# Altium schematic sheet KEYBOARD.SchDoc: KEYBOARD
size A4; Date: 30 08 2013; Author: Rachid AKKOUCHE; CompanyName: MDI; DrawnBy: Rachid AKKOUCHE; Organization: RASoftware; Address1: 52 J03, rue de la crèche; Address2: 77100 MEAUX; Address3: FRANCE; DocumentNumber: BRA201308306C; Revision: C; SheetNumber: 6; SheetTotal: 11; Telephone: +33651604047; Email: rachid.akkouche@wanadoo.fr; Proprietaire: MDI System; Dessinepar: -; Verifiepar: -; Time: 19:00
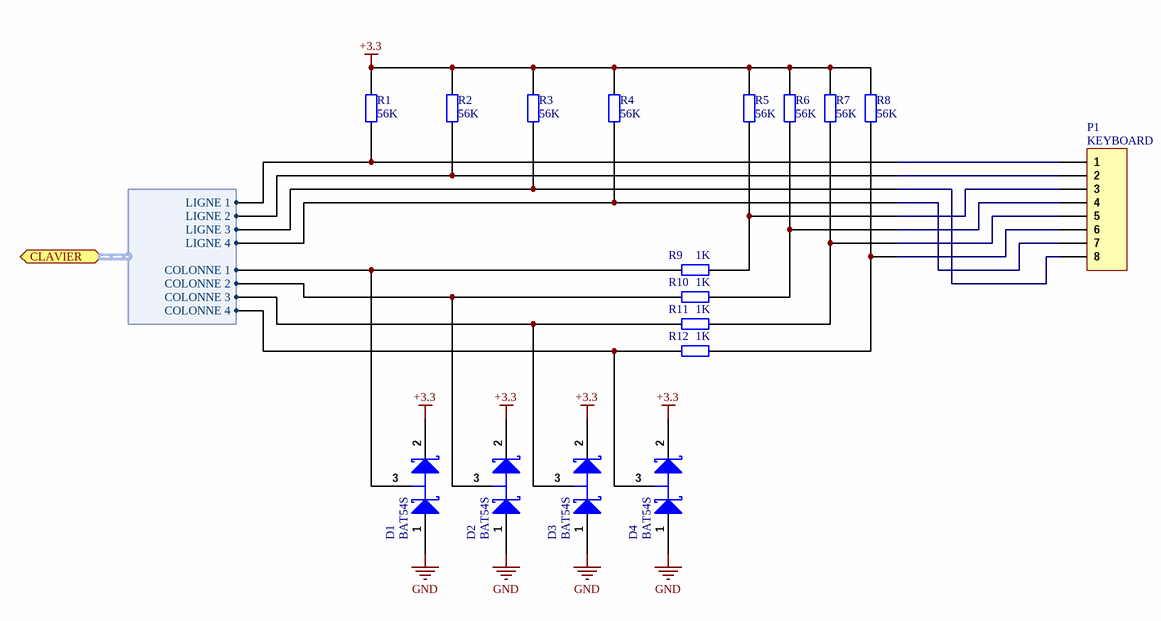
[diagram p0: KEYBOARD.SchDoc]

## Parts
D1  BAT54S  [SOT-23]
D2  BAT54S  [SOT-23]
D3  BAT54S  [SOT-23]
D4  BAT54S  [SOT-23]
P1  KEYBOARD  [M20_1X8]
R1  56K  [R0805]
R2  56K  [R0805]
R3  56K  [R0805]
R4  56K  [R0805]
R5  56K  [R0805]
R6  56K  [R0805]
R7  56K  [R0805]
R8  56K  [R0805]
R9  1K  [R0805]
R10  1K  [R0805]
R11  1K  [R0805]
R12  1K  [R0805]

## Ports
CLAVIER (harness KEYBOARD)

## Harnesses
KEYBOARD: COLONNE 1, COLONNE 2, COLONNE 3, COLONNE 4, LIGNE 1, LIGNE 2, LIGNE 3, LIGNE 4

## Nets
+3.3: D1.2(K) D2.2(K) D3.2(K) D4.2(K) R1.1 R2.1 R3.1 R4.1 R5.1 R6.1 R7.1 R8.1
GND: D1.1(A) D2.1(A) D3.1(A) D4.1(A)
NetD1_3: D1.3(C) R9.1 ; port CLAVIER.COLONNE 1
NetD2_3: D2.3(C) R10.1 ; port CLAVIER.COLONNE 2
NetD3_3: D3.3(C) R11.1 ; port CLAVIER.COLONNE 3
NetD4_3: D4.3(C) R12.1 ; port CLAVIER.COLONNE 4
NetP1_1: P1.1 R1.2 ; port CLAVIER.LIGNE 1
NetP1_2: P1.2 R2.2 ; port CLAVIER.LIGNE 2
NetP1_3: P1.3 R5.2 R9.2
NetP1_4: P1.4 R6.2 R10.2
NetP1_5: P1.5 R7.2 R11.2
NetP1_6: P1.6 R8.2 R12.2
NetP1_7: P1.7 R4.2 ; port CLAVIER.LIGNE 4
NetP1_8: P1.8 R3.2 ; port CLAVIER.LIGNE 3

## Notes on the sheet
- Ce document est la propriété de
- Project:
- Il ne peut être divulgué sans l'accord écrit de l'un de ses représentants dûment mandaté
- Title:
- Number:
- Date:
- Time:
- Size:
- A4
- Revision:
- Sheet
- of
- 52 J03 rue de la crèche
- Draw by:
- 77100 Meaux

## Library data of the parts
D1-D4 = BAT54S: Schottky Barrier Double Diode; Manufacturer: MULTICOMP; Published: 17-Sep-2003; LatestRevisionDate: 12-Dec-2006; LatestRevisionNote: IPC-7351 Footprint Added.; DatasheetVersion: 4-Mar-2002; PackageVersion: May-1999; PackageReference: SOT23; Publisher: Altium Limited; PackageDescription: 3-Pin SOT-23 Package 0.95 mm Pitch, 2.3 mm Lead Span; ComponentLink1Description: Manufacturer Link; ComponentLink1URL: http://www.semiconductors.philips.com/; ComponentLink2Description: Datasheet; ComponentLink2URL: http://www.semiconductors.philips.com/acrobat/datasheets/BAT54_SERIES_4.pdf; Supplier 1: Farnell; Supplier Part Number 1: 1621835; Manufacturer Part Number: BAT54S; RoHS: YES; Stock 1: 51548; Pricing 1: 10=0,102, 250=0,074, 1000=0,06, 3000=0,053 (EUR); ComponentLink3URL: http://www.farnell.com/datasheets/1317753.pdf; ComponentLink3Description: http://www.farnell.com/datasheets/1317753.pdf
P1 = Header 8: Header, 8-Pin; Manufacturer: HARWIN; Manufacturer Part Number: M20-8770842; LatestRevisionDate: 17-Jul-2002; LatestRevisionNote: Re-released for DXP Platform.; Publisher: Altium Limited; Supplier 1: Farnell; Supplier Part Number 1: 1517385; RoHS: YES; Pricing 1: 10=0,9, 20=0,86, 50=0,8, 100=0,77, 250=0,75, 500=0,71 (EUR); ComponentLink1URL: http://www.farnell.com/datasheets/1089525.pdf; ComponentLink1Description: http://www.farnell.com/datasheets/1089525.pdf; ComponentLink2URL: http://www.farnell.com/datasheets/5481.pdf; ComponentLink2Description: http://www.farnell.com/datasheets/5481.pdf
R1-R8 = Resistor 0805 56K: Resistor; Manufacturer: MULTICOMP; Manufacturer Part Number: MC0.1W08051%56KFR; Product Range: MULTICOMP - MC Series; Résistance: 56; Puissance: 100; Tolérance de résistance: ± 1%; Type de boîtier de résistance: 0805; Type de résistance: Couche épaisse; Coefficient de température: ± 100; Tension: 150; Type de packaging: Full Reel; Resistor Mounting: CMS; Resistor Terminals: (Non Disponible); Supplier 1: Farnell; RoHS: YES; Pricing 1: 5000=0,001 (EUR); MSL: (Non Applicable); ComponentLink1URL: http://www.farnell.com/datasheets/1716700.pdf; ComponentLink1Description: http://www.farnell.com/datasheets/1716700.pdf; Supplier Part Number 1: 2129258
R9-R12 = Res2: Resistor; Manufacturer: MULTICOMP; Manufacturer Part Number: MC0.1W08051%1KFR; Product Range: MULTICOMP - MC Series; Résistance: 1; Puissance: 100; Tolérance de résistance: ± 1%; Type de boîtier de résistance: 0805; Type de résistance: Couche épaisse; Coefficient de température: ± 100; Tension: 150; Type de packaging: Full Reel; Resistor Mounting: CMS; Supplier 1: Farnell; Supplier Part Number 1: 2129113; RoHS: YES; Pricing 1: 5000=0,001 (EUR); MSL: MSL 1 - Illimité; ComponentLink1URL: http://www.farnell.com/datasheets/1636796.pdf; ComponentLink1Description: http://www.farnell.com/datasheets/1636796.pdf